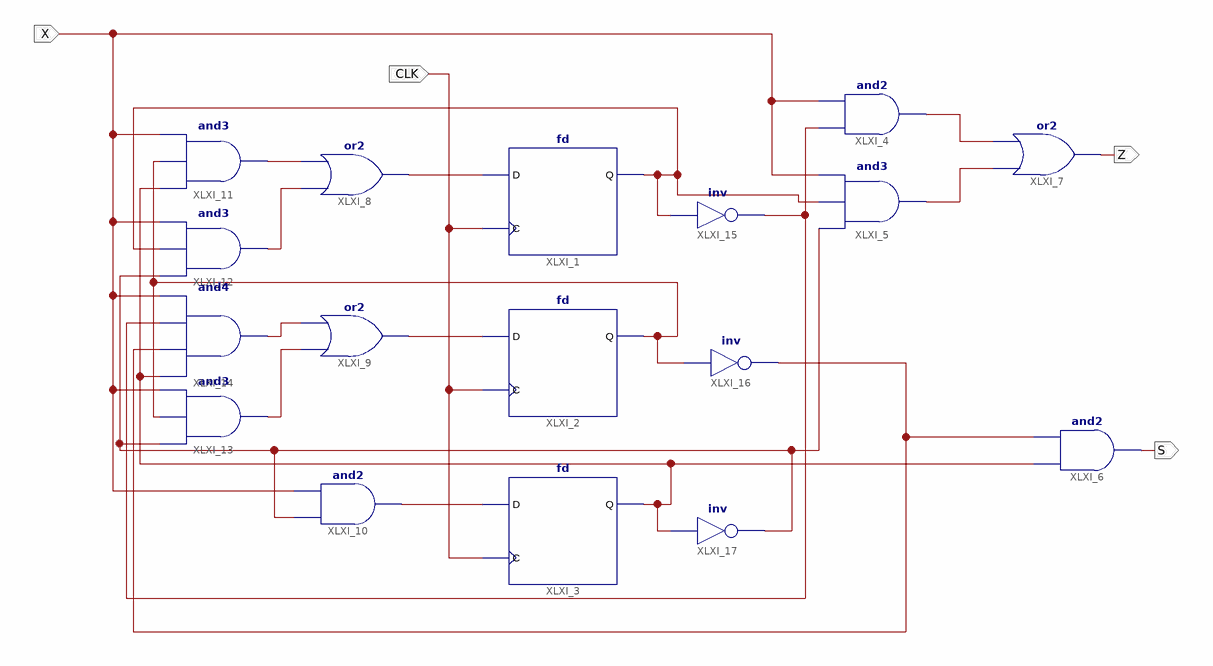
[diagram p0: schematic sheet 1]
// Xilinx ISE schematic C4_22.sch (kintex7) as structural Verilog: 17 symbols, 6 ports
module C4_22 (
  input  X,
  input  XLXN_24,
  input  XLXN_27,
  input  CLK,
  output S,
  output Z
);

  wire XLXN_12, XLXN_13, XLXN_14, XLXN_17, XLXN_18, XLXN_19, XLXN_20, XLXN_21, XLXN_22, XLXN_23, XLXN_32,
       XLXN_33, XLXN_38, XLXN_39, XLXN_42;

  fd XLXI_1 (.C(CLK), .D(XLXN_23), .Q(XLXN_32));
  fd XLXI_2 (.C(CLK), .D(XLXN_22), .Q(XLXN_33));
  fd XLXI_3 (.C(CLK), .D(XLXN_38), .Q(XLXN_17));
  and XLXI_4 (XLXN_12, XLXN_42, X);
  and XLXI_5 (XLXN_13, XLXN_39, XLXN_32, X);
  and XLXI_6 (S, XLXN_17, XLXN_14);
  or XLXI_7 (Z, XLXN_13, XLXN_12);
  or XLXI_8 (XLXN_23, XLXN_19, XLXN_18);
  or XLXI_9 (XLXN_22, XLXN_21, XLXN_20);
  and XLXI_10 (XLXN_38, XLXN_39, X);
  and XLXI_11 (XLXN_18, XLXN_17, XLXN_33, X);
  and XLXI_12 (XLXN_19, XLXN_39, XLXN_32, X);
  and XLXI_13 (XLXN_21, XLXN_39, XLXN_33, X);
  and XLXI_14 (XLXN_20, XLXN_17, XLXN_14, XLXN_42, X);
  not XLXI_15 (XLXN_42, XLXN_32);
  not XLXI_16 (XLXN_14, XLXN_33);
  not XLXI_17 (XLXN_39, XLXN_17);
endmodule
